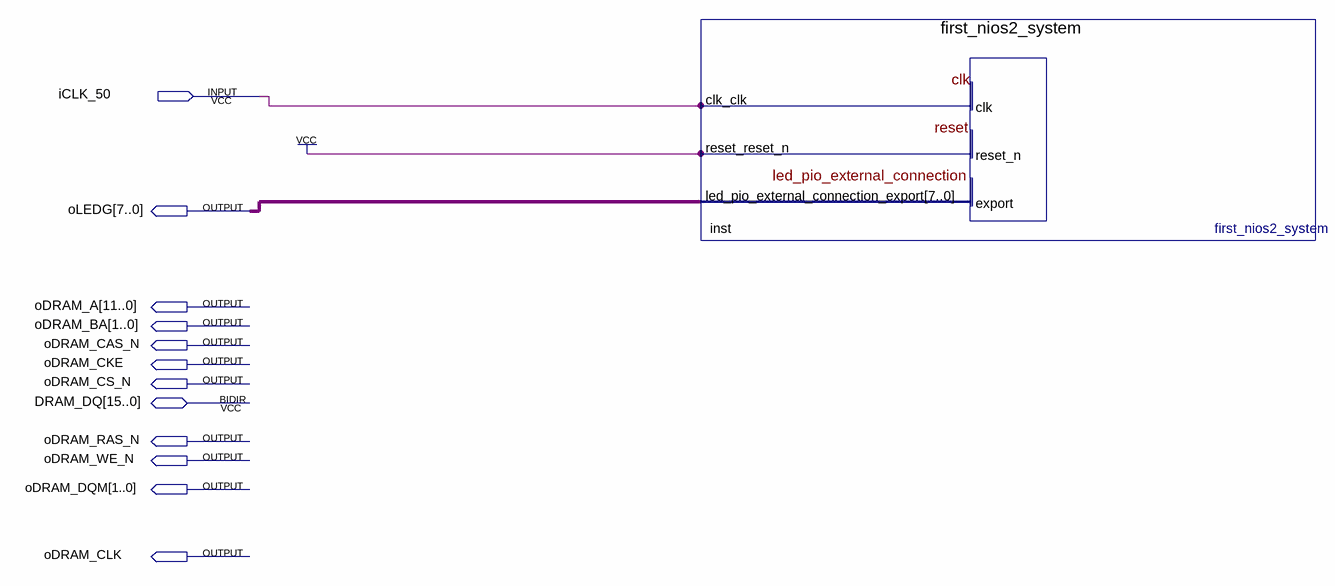
[diagram p0: schematic sheet]
// Quartus schematic hello_world.bdf as structural Verilog: 1 symbols, 12 pins
module hello_world (
  input  iCLK_50,
  inout  [15:0] DRAM_DQ,
  output [7:0] oLEDG,
  output [11:0] oDRAM_A,
  output [1:0] oDRAM_BA,
  output oDRAM_CAS_N,
  output oDRAM_CKE,
  output oDRAM_CS_N,
  output oDRAM_RAS_N,
  output oDRAM_WE_N,
  output [1:0] oDRAM_DQM,
  output oDRAM_CLK
);

  first_nios2_system inst (.clk_clk(iCLK_50), .reset_reset_n(1'b1), .led_pio_external_connection_export(oLEDG));
endmodule
